# EAGLE board Papilio_Benchy (EAGLE 6.5.0)
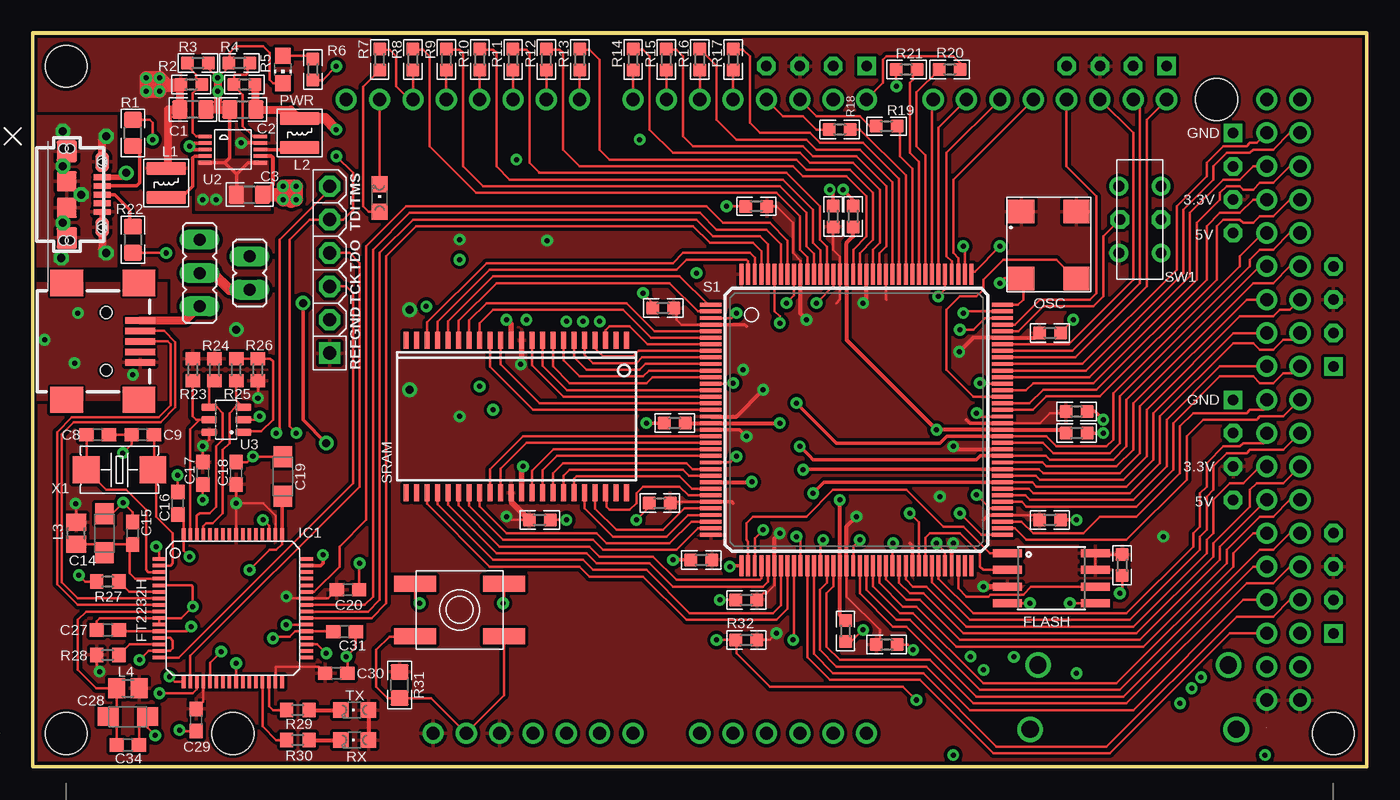
[diagram p6: board, top side]
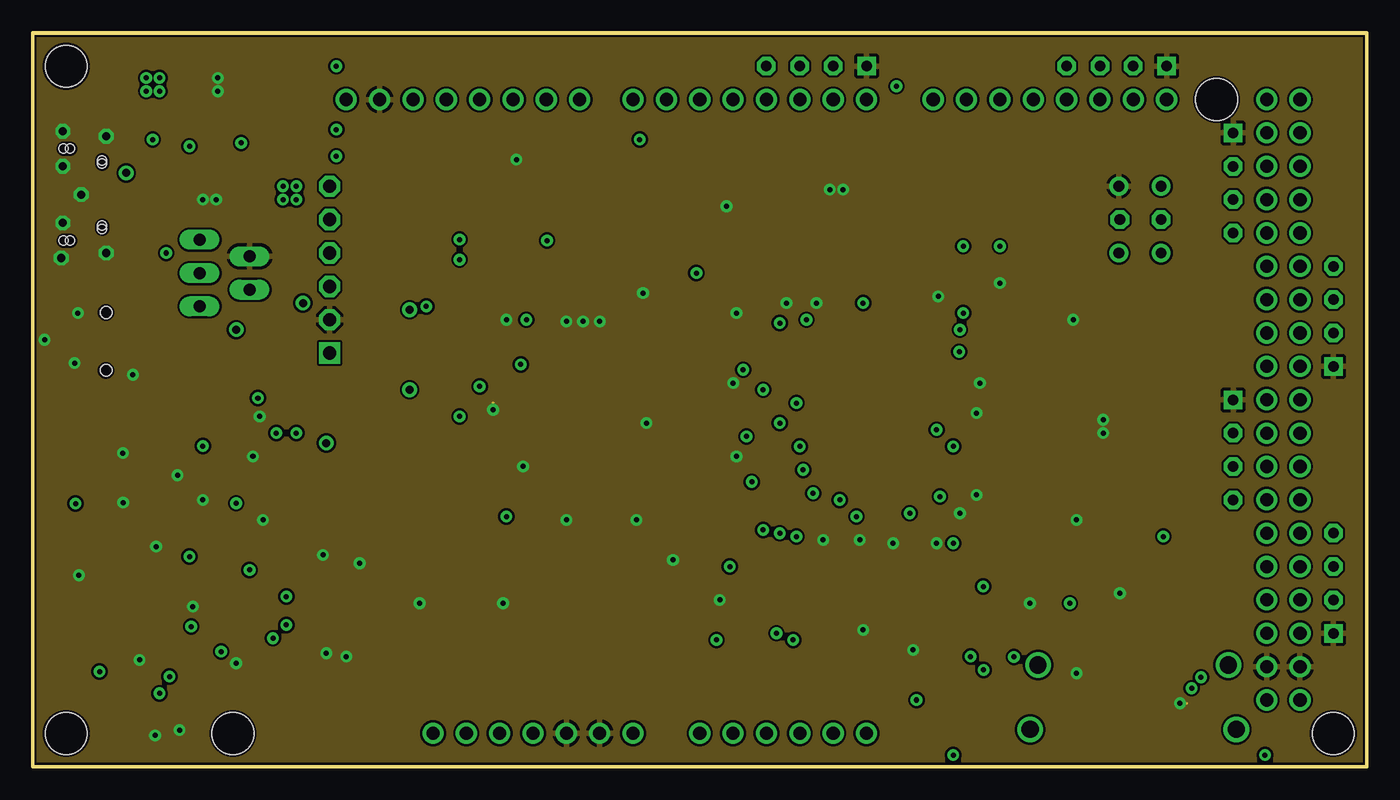
[diagram p7: board, inner layer Route2]
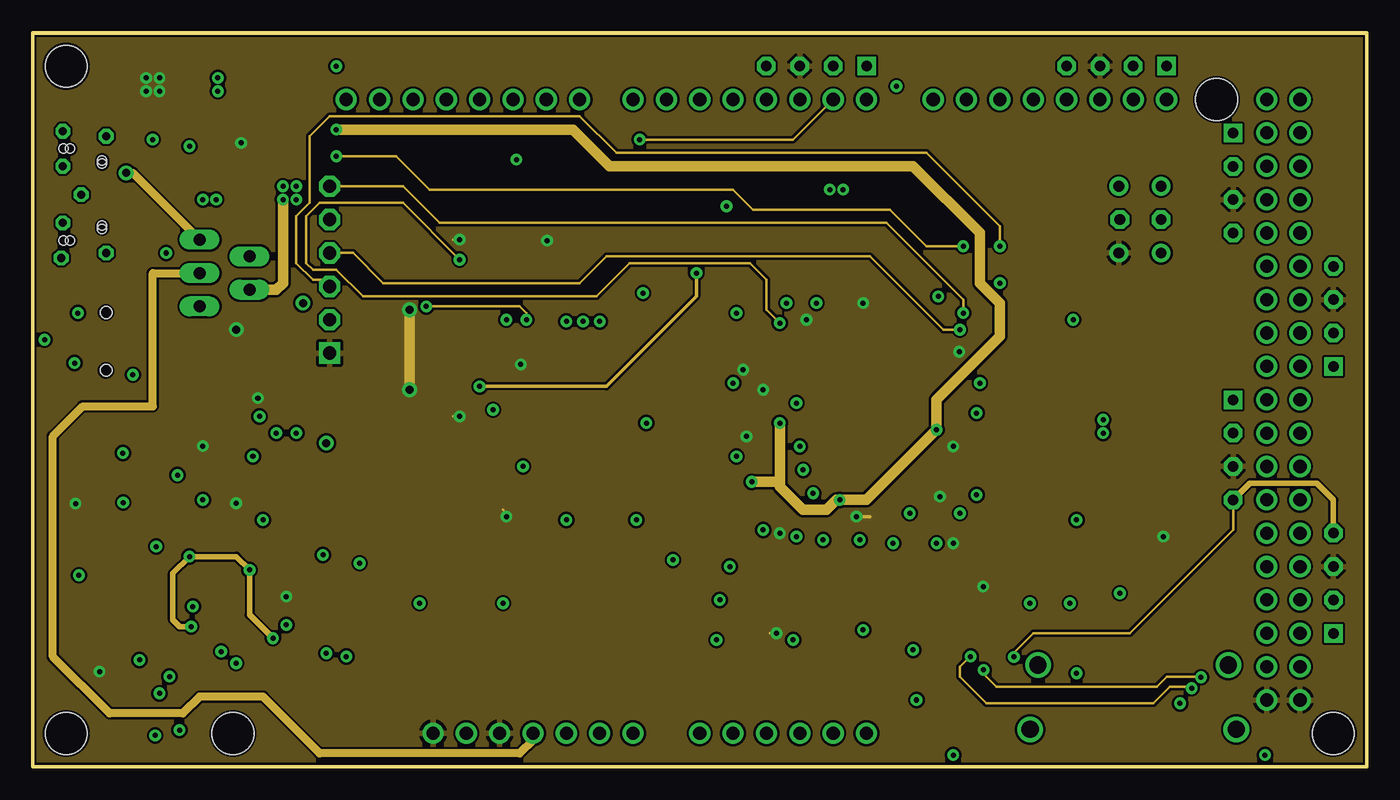
[diagram p8: board, inner layer Route3]
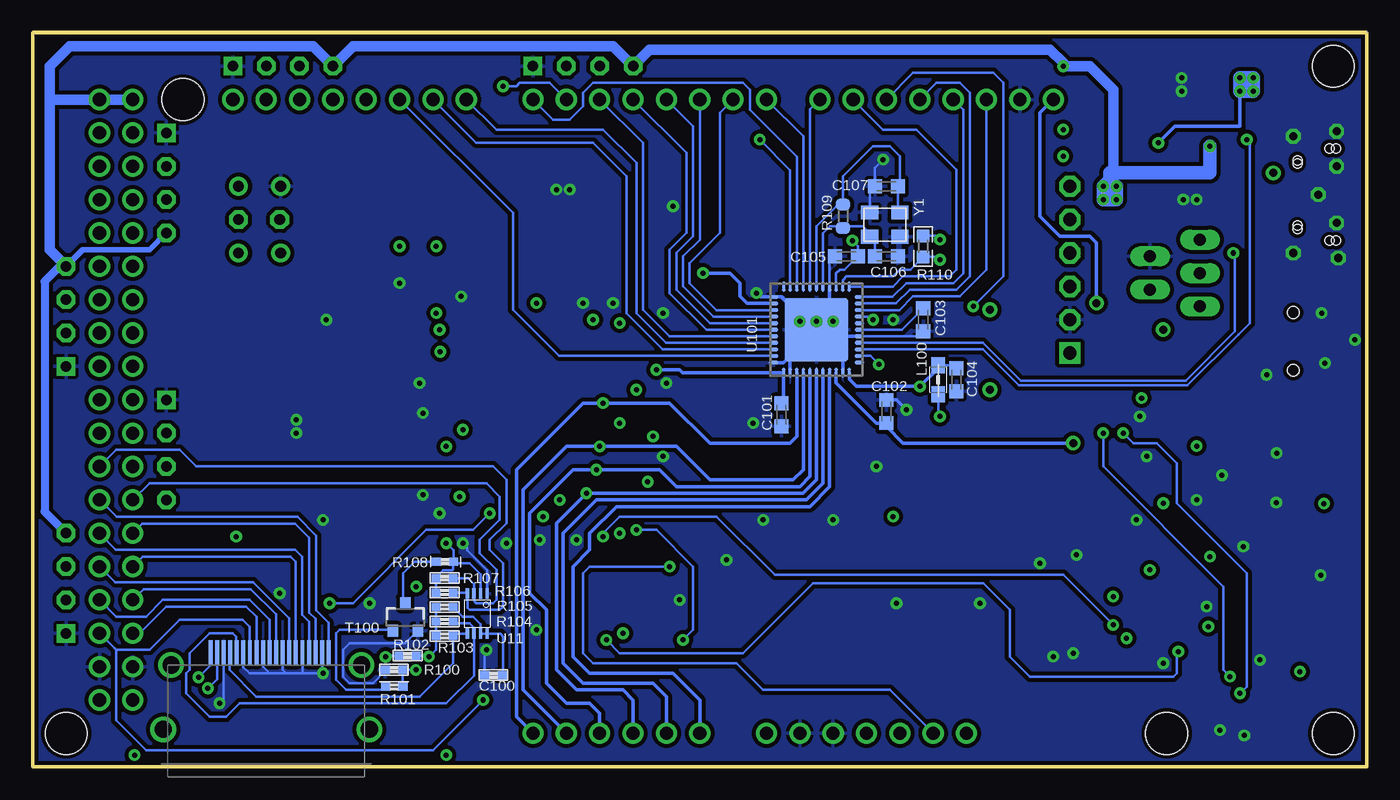
[diagram p9: board, bottom side, seen from below]

Size 101.6 x 55.88 mm. Coordinates in mm from the lower left corner, seen from the top.
Outline: 0,55.88 101.6,55.88 101.6,0 0,0 0,55.88
Outline: 0,55.88 57.15,55.88
Copper layers (1*2+3*16): Top 0.035mm / dielectric 1.5mm / Route2 0.035mm / dielectric 0.15mm / Route3 0.035mm / dielectric 0.2mm / Bottom 0.035mm
Design rules "SparkFun_Derived_GoldePheonix_7mil *": minimum track width 7mil, minimum drill 15mil, track to track 7mil, track to pad 7mil, pad to pad 7mil, via to via 7mil, smd to smd 7mil, copper to edge 7mil, drill to drill 7mil, minimum pad ring 12mil, minimum via ring 10mil, stop-mask expansion 4mil, vias tented up to drill 24mil, thermal gap 10mil
Net classes: 0 default: width 0.178 mm, drill 0.381 mm, clearance 0.178 mm; 1 Power: width 0.254 mm, drill 0.381 mm, clearance 0.178 mm; 2 gnd: width 0.254 mm, drill 0.61 mm, clearance 0.254 mm; 3 usbvcc: width 0.254 mm, drill 0.61 mm, clearance 0.254 mm; 4 aref: width 0.254 mm, drill 0.61 mm, clearance 0.254 mm
Holes 3.2 mm at 2.54,2.54 2.54,53.34 99.06,2.54

## Footprints (pad centres in the part's own frame; a part is rotated, then mirrored left to right if it is on the bottom)
CON2_USB_MICRO_B_AT = smd 0.406 x 1.346: P1 -1.321,2.692; P2 -0.66,2.692; P3 0,2.692; P4 0.66,2.692; P5 1.321,2.692 | smd 1.651 x 1.549: S1 -3.302,0; S2 3.302,0 | smd 1.524 x 1.016: S3 -2.489,2.692; S4 2.489,2.692 | smd 1.524 x 1.524: S5 -1.016,0; S6 1.016,0 | hole 0.7: -3.505,0.254; -3.505,-0.254; 3.505,0.254; 3.505,-0.254; -2.616,2.692; -2.362,2.692; 2.362,2.692; 2.616,2.692
0805 = smd 1.2 x 1.4: 1 -1,0; 2 1,0
0603 = smd 1 x 1: 1 -0.8,0; 2 0.8,0
C603 = smd 1.1 x 1: 1 -0.85,0; 2 0.85,0
SMC_A = smd 1.6 x 1.4: + -1.5,0; - 1.5,0
0402 = smd 0.7 x 0.6: 1 -0.655,0; 2 0.655,0
C0603K = smd 1.05 x 1.08: 1 -0.875,0; 2 0.875,0
SO08-EIAJ = smd 0.61 x 2.21: 1 -1.905,-3.378; 2 -0.635,-3.378; 3 0.635,-3.378; 4 1.905,-3.378; 5 1.905,3.353; 6 0.635,3.353; 7 -0.635,3.353; 8 -1.905,3.353
CONN_USB_MINI-B = smd 2 x 2.5: BODY@1 -4.45,2.5; BODY@2 4.45,2.5; BODY@3 4.45,-3; BODY@4 -4.45,-3 | smd 0.5 x 2.3: D+ 0,2.6; D- -0.8,2.6; GND 1.6,2.6; ID 0.8,2.6; VUSB -1.6,2.6 | hole 0.9: -2.2,0; 2.2,0
FCI-HDMI-TYPE-A-RECEPT = smd 1.9 x 0.3: 1 -0.95,4.5; 2 -0.95,4; 3 -0.95,3.5; 4 -0.95,3; 5 -0.95,2.5; 6 -0.95,2; 7 -0.95,1.5; 8 -0.95,1; 9 -0.95,0.5; 10 -0.95,0; 11 -0.95,-0.5; 12 -0.95,-1; 13 -0.95,-1.5; 14 -0.95,-2; 15 -0.95,-2.5; 16 -0.95,-3; 17 -0.95,-3.5; 18 -0.95,-4; 19 -0.95,-4.5 | drill 1.3: SH1 4.9,7.6; SH2 0,7; SH3 0,-7.5; SH4 4.9,-8.1
LQFP64 = smd 1 x 0.27: 1 -5.6,3.75; 2 -5.6,3.25; 3 -5.6,2.75; 4 -5.6,2.25; 5 -5.6,1.75; 6 -5.6,1.25; 7 -5.6,0.75; 8 -5.6,0.25; 9 -5.6,-0.25; 10 -5.6,-0.75; 11 -5.6,-1.25; 12 -5.6,-1.75; 13 -5.6,-2.25; 14 -5.6,-2.75; 15 -5.6,-3.25; 16 -5.6,-3.75; 33 5.6,-3.75; 34 5.6,-3.25; 35 5.6,-2.75; 36 5.6,-2.25; 37 5.6,-1.75; 38 5.6,-1.25; 39 5.6,-0.75; 40 5.6,-0.25; 41 5.6,0.25; 42 5.6,0.75; 43 5.6,1.25; 44 5.6,1.75; 45 5.6,2.25; 46 5.6,2.75; 47 5.6,3.25; 48 5.6,3.75 | smd 0.27 x 1: 17 -3.75,-5.6; 18 -3.25,-5.6; 19 -2.75,-5.6; 20 -2.25,-5.6; 21 -1.75,-5.6; 22 -1.25,-5.6; 23 -0.75,-5.6; 24 -0.25,-5.6; 25 0.25,-5.6; 26 0.75,-5.6; 27 1.25,-5.6; 28 1.75,-5.6; 29 2.25,-5.6; 30 2.75,-5.6; 31 3.25,-5.6; 32 3.75,-5.6; 49 3.75,5.6; 50 3.25,5.6; 51 2.75,5.6; 52 2.25,5.6; 53 1.75,5.6; 54 1.25,5.6; 55 0.75,5.6; 56 0.25,5.6; 57 -0.25,5.6; 58 -0.75,5.6; 59 -1.25,5.6; 60 -1.75,5.6; 61 -2.25,5.6; 62 -2.75,5.6; 63 -3.25,5.6; 64 -3.75,5.6
VLS3015 = smd 3 x 1: 1 0,1.1; 2 0,-1.1
FB603 = smd 1.3 x 1.5: 1 -0.85,0; 2 0.85,0
0805' = smd 1.2 x 1: 1 -1.1,0; 2 1.1,0
CHIPLED_0805 = smd 1.2 x 1.2: A 0,-1.05; C 0,1.05
OSC1 = smd 1.8 x 2: 1@1 0,0; 2@2 5.08,0; 3@3 5.08,4.2; 4@4 0,4.2
CHIP-LED0805 = smd 1.2 x 1.2: A 0,-1.05; C 0,1.05
JP1 = drill 0.914 long: 1 0,-1.27; 2 0,1.27
JP2 = drill 0.914 long: 1 -2.54,0; 2 0,0; 3 2.54,0
R603 = smd 1 x 1.1: 1 -0.85,0; 2 0.85,0
R0603-ROUND = smd 0.898 x 1.1: 1 -0.889,0; 2 0.889,0
LED-805 = smd 1.2 x 1.2: A 0,-1.05; C 0,1.05
TQ144 = smd 1.6 x 0.3: 1 -11.1,8.75; 2 -11.1,8.25; 3 -11.1,7.75; 4 -11.1,7.25; 5 -11.1,6.75; 6 -11.1,6.25; 7 -11.1,5.75; 8 -11.1,5.25; 9 -11.1,4.75; 10 -11.1,4.25; 11 -11.1,3.75; 12 -11.1,3.25; 13 -11.1,2.75; 14 -11.1,2.25; 15 -11.1,1.75; 16 -11.1,1.25; 17 -11.1,0.75; 18 -11.1,0.25; 19 -11.1,-0.25; 20 -11.1,-0.75; 21 -11.1,-1.25; 22 -11.1,-1.75; 23 -11.1,-2.25; 24 -11.1,-2.75; 25 -11.1,-3.25; 26 -11.1,-3.75; 27 -11.1,-4.25; 28 -11.1,-4.75; 29 -11.1,-5.25; 30 -11.1,-5.75; 31 -11.1,-6.25; 32 -11.1,-6.75; 33 -11.1,-7.25; 34 -11.1,-7.75; 35 -11.1,-8.25; 36 -11.1,-8.75; 73 11.1,-8.75; 74 11.1,-8.25; 75 11.1,-7.75; 76 11.1,-7.25; 77 11.1,-6.75; 78 11.1,-6.25; 79 11.1,-5.75; 80 11.1,-5.25; 81 11.1,-4.75; 82 11.1,-4.25; 83 11.1,-3.75; 84 11.1,-3.25; 85 11.1,-2.75; 86 11.1,-2.25; 87 11.1,-1.75; 88 11.1,-1.25; 89 11.1,-0.75; 90 11.1,-0.25; 91 11.1,0.25; 92 11.1,0.75; 93 11.1,1.25; 94 11.1,1.75; 95 11.1,2.25; 96 11.1,2.75; 97 11.1,3.25; 98 11.1,3.75; 99 11.1,4.25; 100 11.1,4.75; 101 11.1,5.25; 102 11.1,5.75; 103 11.1,6.25; 104 11.1,6.75; 105 11.1,7.25; 106 11.1,7.75; 107 11.1,8.25; 108 11.1,8.75 | smd 0.3 x 1.6: 37 -8.75,-11.1; 38 -8.25,-11.1; 39 -7.75,-11.1; 40 -7.25,-11.1; 41 -6.75,-11.1; 42 -6.25,-11.1; 43 -5.75,-11.1; 44 -5.25,-11.1; 45 -4.75,-11.1; 46 -4.25,-11.1; 47 -3.75,-11.1; 48 -3.25,-11.1; 49 -2.75,-11.1; 50 -2.25,-11.1; 51 -1.75,-11.1; 52 -1.25,-11.1; 53 -0.75,-11.1; 54 -0.25,-11.1; 55 0.25,-11.1; 56 0.75,-11.1; 57 1.25,-11.1; 58 1.75,-11.1; 59 2.25,-11.1; 60 2.75,-11.1; 61 3.25,-11.1; 62 3.75,-11.1; 63 4.25,-11.1; 64 4.75,-11.1; 65 5.25,-11.1; 66 5.75,-11.1; 67 6.25,-11.1; 68 6.75,-11.1; 69 7.25,-11.1; 70 7.75,-11.1; 71 8.25,-11.1; 72 8.75,-11.1; 109 8.75,11.1; 110 8.25,11.1; 111 7.75,11.1; 112 7.25,11.1; 113 6.75,11.1; 114 6.25,11.1; 115 5.75,11.1; 116 5.25,11.1; 117 4.75,11.1; 118 4.25,11.1; 119 3.75,11.1; 120 3.25,11.1; 121 2.75,11.1; 122 2.25,11.1; 123 1.75,11.1; 124 1.25,11.1; 125 0.75,11.1; 126 0.25,11.1; 127 -0.25,11.1; 128 -0.75,11.1; 129 -1.25,11.1; 130 -1.75,11.1; 131 -2.25,11.1; 132 -2.75,11.1; 133 -3.25,11.1; 134 -3.75,11.1; 135 -4.25,11.1; 136 -4.75,11.1; 137 -5.25,11.1; 138 -5.75,11.1; 139 -6.25,11.1; 140 -6.75,11.1; 141 -7.25,11.1; 142 -7.75,11.1; 143 -8.25,11.1; 144 -8.75,11.1
TSOP44-II = smd 0.4 x 1.3: 1 -8.4,-5.8; 2 -7.6,-5.8; 3 -6.8,-5.8; 4 -6,-5.8; 5 -5.2,-5.8; 6 -4.4,-5.8; 7 -3.6,-5.8; 8 -2.8,-5.8; 9 -2,-5.8; 10 -1.2,-5.8; 11 -0.4,-5.8; 12 0.4,-5.8; 13 1.2,-5.8; 14 2,-5.8; 15 2.8,-5.8; 16 3.6,-5.8; 17 4.4,-5.8; 18 5.2,-5.8; 19 6,-5.8; 20 6.8,-5.8; 21 7.6,-5.8; 22 8.4,-5.8; 23 8.4,5.8; 24 7.6,5.8; 25 6.8,5.8; 26 6,5.8; 27 5.2,5.8; 28 4.4,5.8; 29 3.6,5.8; 30 2.8,5.8; 31 2,5.8; 32 1.2,5.8; 33 0.4,5.8; 34 -0.4,5.8; 35 -1.2,5.8; 36 -2,5.8; 37 -2.8,5.8; 38 -3.6,5.8; 39 -4.4,5.8; 40 -5.2,5.8; 41 -6,5.8; 42 -6.8,5.8; 43 -7.6,5.8; 44 -8.4,5.8
6P-2CH-2.54-9.1X3.5X3.2+2H = drill 0.813 pad 1.27: CH1A -2.54,-1.6; CH1B 2.54,-1.6; CH2A -2.54,1.6; CH2B 2.54,1.6 | drill 0.813 pad 1.27 octagon: COM1 0,-1.6; COM2 0,1.524
EVQ-Q2 = smd 3.2 x 1.2: A -3.4,-2; A' 3.4,-2; B -3.4,2; B' 3.4,2
SOT23-3 = smd 0.8 x 0.9: 1 -0.95,-1; 2 0.95,-1; 3 0,1.1
ARDUINO_MEGA_SHIELD = drill 1 pad 1.422: 3.3V 50.8,26.67; 3V3@1 48.26,85.09; 3V3@2 48.26,87.63; 5V@0 50.8,29.21; 5V@1 2.54,85.09; 5V@2 2.54,87.63; A0 50.8,41.91; A1 50.8,44.45; A2 50.8,46.99; A3 50.8,49.53; A4 50.8,52.07; A5 50.8,54.61; AREF 2.54,14.986; D2 2.54,49.53; D3 2.54,46.99; D4 2.54,44.45; D5 2.54,41.91; D6 2.54,39.37; D7 2.54,36.83; D8 2.54,32.766; D9 2.54,30.226; D10 2.54,27.686; D11 2.54,25.146; D12 2.54,22.606; D13 2.54,20.066; D14 2.54,59.69; D15 2.54,62.23; D16 2.54,64.77; D17 2.54,67.31; D18 2.54,69.85; D19 2.54,72.39; D20 2.54,74.93; D21 2.54,77.47; D22 5.08,85.09; D23 5.08,87.63; D24 7.62,85.09; D25 7.62,87.63; D26 10.16,85.09; D27 10.16,87.63; D28 12.7,85.09; D29 12.7,87.63; D30 15.24,85.09; D31 15.24,87.63; D32 17.78,85.09; D33 17.78,87.63; D34 20.32,85.09; D35 20.32,87.63; D36 22.86,85.09; D37 22.86,87.63; D38 25.4,85.09; D39 25.4,87.63; D40 27.94,85.09; D41 27.94,87.63; D42 30.48,85.09; D43 30.48,87.63; D44 33.02,85.09; D45 33.02,87.63; D46 35.56,85.09; D47 35.56,87.63; D48 38.1,85.09; D49 38.1,87.63; D50 40.64,85.09; D51 40.64,87.63; D52 43.18,85.09; D53 43.18,87.63; GND@0 50.8,31.75; GND@1 50.8,34.29; GND@2 2.54,17.526; GND@3 45.72,85.09; GND@4 45.72,87.63; IOREF 50.8,21.59; RES 50.8,24.13; RX 2.54,54.61; TX 2.54,52.07; VIN 50.8,36.83 | hole 3.2: 2.54,81.28; 50.8,6.35
MSOP10 = smd 0.28 x 1: 1 -1,-2.1; 2 -0.5,-2.1; 3 0,-2.1; 4 0.5,-2.1; 5 1,-2.1; 6 1,2.1; 7 0.5,2.1; 8 0,2.1; 9 -0.5,2.1; 10 -1,2.1
SOT23-6 = smd 0.55 x 1.2: 1 -0.95,-1.3; 2 0,-1.3; 3 0.95,-1.3; 4 0.95,1.3; 5 0,1.3; 6 -0.95,1.3
PSOP-8 = smd 0.25 x 0.8: 1 -0.73,-1.52; 2 -0.23,-1.52; 3 0.27,-1.52; 4 0.77,-1.52; 5 0.77,1.53; 6 0.27,1.53; 7 -0.23,1.53; 8 -0.73,1.53
QFN44ML7X7 = smd 0.75 x 0.275: 1 -3.275,2.5; 2 -3.275,2; 3 -3.275,1.5; 4 -3.275,1; 5 -3.275,0.5; 6 -3.275,0; 7 -3.275,-0.5; 8 -3.275,-1; 9 -3.275,-1.5; 10 -3.275,-2; 11 -3.275,-2.5; 23 3.275,-2.5; 24 3.275,-2; 25 3.275,-1.5; 26 3.275,-1; 27 3.275,-0.5; 28 3.275,0; 29 3.275,0.5; 30 3.275,1; 31 3.275,1.5; 32 3.275,2; 33 3.275,2.5 | smd 0.275 x 0.75: 12 -2.5,-3.275; 13 -2,-3.275; 14 -1.5,-3.275; 15 -1,-3.275; 16 -0.5,-3.275; 17 0,-3.275; 18 0.5,-3.275; 19 1,-3.275; 20 1.5,-3.275; 21 2,-3.275; 22 2.5,-3.275; 34 2.5,3.275; 35 2,3.275; 36 1.5,3.275; 37 1,3.275; 38 0.5,3.275; 39 0,3.275; 40 -0.5,3.275; 41 -1,3.275; 42 -1.5,3.275; 43 -2,3.275; 44 -2.5,3.275 | smd 4.826 x 4.826: EXP 0,0
JTAG = drill 1.016 octagon: JTAG_GND 10.16,0; JTAG_TCK 7.62,0; JTAG_TDI 2.54,0; JTAG_TDO 5.08,0; JTAG_TMS 0,0 | drill 1.016 square: JTAG_REF 12.7,0
POWER_NO_TEXT = drill 0.8 square: P1 0,3.81 | drill 0.8 octagon: P2 0,1.27; P3 0,-1.27; P4 0,-3.81
4X6 = smd 2.032 x 2.032: 1 -2.54,0; 2 2.54,0
CRYSTAL-3.2-2.5 = smd 1.3 x 1.05: 1 -1.15,-0.925; 2 1.15,-0.925; 3 1.15,0.925; 4 -1.15,0.925

## Placement (x,y rotation side)
AVRUSB  USB MICRO  [CON2_USB_MICRO_B_AT]  2.59,43.56 270 top
C1  22u/6V3  [0805]  12.19,50.04 180 top
C2  22u/6V3  [0805]  16,50.04 0 top
C3  10u/10V  [0805]  16.51,43.56 0 top
C4  .1uF  [0603]  48.01,34.92 180 top
C5  .1uF  [0603]  55.12,42.67 180 top
C6  .1uF  [0603]  60.96,41.91 90 top
C7  .1uF  [0603]  62.48,41.91 90 top
C8  27pF  [C603]  4.95,25.27 0 top
C9  27pF  [C603]  8.38,25.27 180 top
C10  .1uF  [0603]  48.9,26.16 180 top
C11  .1uF  [0603]  77.47,33.02 0 top
C12  .1uF  [0603]  79.5,27.05 0 top
C13  .1uF  [0603]  79.5,25.4 0 top
C14  4.7uF  [SMC_A]  5.46,17.78 90 top
C15  0.1uF  [C603]  7.62,17.78 90 top
C16  0.1uF  [C603]  11.05,20.07 90 top
C17  0.1uF  [C603]  12.95,22.35 270 top
C18  0.1uF  [C603]  15.49,22.35 90 top
C19  3.3uF  [SMC_A]  19.05,22.1 90 top
C20  0.1uF  [C603]  24,13.46 0 top
C21  .1uF  [0603]  38.61,18.8 0 top
C22  .1uF  [0603]  47.75,20.07 180 top
C23  .1uF  [0603]  50.93,15.75 180 top
C24  .1uF  [0603]  54.36,12.7 180 top
C25  .1uF  [0603]  77.47,18.8 0 top
C26  .1uF  [0603]  82.98,15.34 270 top
C27  0.1uF  [C603]  5.71,10.41 180 top
C28  4.7uF  [SMC_A]  7.24,3.81 0 top
C29  0.1uF  [C603]  12.45,3.56 270 top
C30  0.1uF  [C603]  23.11,7.11 0 top
C31  0.1uF  [C603]  23.75,10.29 0 top
C32  .1uF  [0603]  61.9,10.34 270 top
C33  .1uF  [0603]  65.05,9.3 0 top
C34  0.1uF  [C603]  7.24,1.65 0 top
C100  1uF  [0402]  66.52,6.97 180 bottom
C101  100n  [C0603K]  44.58,26.8 270 bottom
C102  100n  [C0603K]  36.58,27.05 270 bottom
C103  1uF  [C0603K]  33.78,34.04 270 bottom
C104  1uF  [C0603K]  31.24,29.46 270 bottom
C105  100n  [C0603K]  39.62,38.86 180 bottom
C106  22p  [C0603K]  36.58,38.86 180 bottom
C107  22p  [C0603K]  36.58,44.2 180 bottom
FLASH  FLASH-SPI-25XXSMD1  [SO08-EIAJ]  77.6,14.35 270 top
FPGAUSB  CONN_USB  [CONN_USB_MINI-B]  5.59,32.38 270 top
HDMI  HDMI-TYPE-A-RECEPTICALFCI10029449  [FCI-HDMI-TYPE-A-RECEPT]  83.57,7.74 270 bottom
IC1  FT2232H  [LQFP64]  15.24,12.06 0 top
L1  3.3uH  [VLS3015]  10.16,44.45 180 top
L2  3.3uH  [VLS3015]  20.32,48.26 180 top
L3  [FB603]  3.3,17.78 90 top
L4  [FB603]  7.24,5.97 0 top
L100  MH2029-300Y  [0805']  32.64,29.46 90 bottom
LED  Yellow  [CHIPLED_0805]  26.42,43.31 0 top
OSC  [OSC1]  75.29,42.27 270 top
PWR  Green  [CHIP-LED0805]  19.05,53.09 180 top
PWRIN  [JP1]  16.51,37.59 0 top
PWRSEL  [JP2]  12.7,37.59 90 top
R1  22R  [0805]  7.62,48.26 90 top
R2  6K8 1%  [0603]  12.06,51.94 180 top
R3  1K5 1%  [0603]  12.57,53.59 180 top
R4  1K5 1%  [0603]  15.75,53.59 0 top
R5  1K5 1%  [0603]  16.13,51.94 0 top
R6  1K8  [0603]  21.34,53.09 270 top
R7  1K  [0603]  26.42,53.85 90 top
R8  390  [0603]  28.96,53.85 270 top
R9  390  [0603]  31.5,53.85 270 top
R10  390  [0603]  34.04,53.85 270 top
R11  390  [0603]  36.58,53.85 270 top
R12  390  [0603]  39.12,53.85 270 top
R13  390  [0603]  41.66,53.85 270 top
R14  390  [0603]  45.72,53.85 270 top
R15  390  [0603]  48.26,53.85 270 top
R16  390  [0603]  50.8,53.85 270 top
R17  390  [0603]  53.34,53.85 270 top
R18  390  [0603]  61.47,48.51 180 top
R19  390  [0603]  65.02,48.77 180 top
R20  390  [0603]  66.55,53.09 180 top
R21  390  [0603]  69.85,53.09 0 top
R22  22R  [0805]  7.62,40.13 270 top
R23  10k  [R603]  12.19,30.23 90 top
R24  10k  [R603]  13.84,30.23 90 top
R25  2.2k  [R603]  15.49,30.23 270 top
R26  10k  [R603]  17.14,30.23 270 top
R27  12k 1%  [R603]  5.71,14.1 0 top
R28  10k  [R603]  5.71,8.51 0 top
R29  470  [R603]  20.19,4.32 0 top
R30  470  [R603]  20.19,2.03 0 top
R31  47K  [0805]  27.94,6.22 90 top
R32  4.7K  [0603]  54.36,9.65 0 top
R100  10K  [0402]  74.1,7.38 0 bottom
R101  10K  [0402]  74.07,6.08 180 bottom
R102  0  [0402]  73.05,8.45 180 bottom
R103  1K  [0402]  70.23,9.96 0 bottom
R104  1K  [0402]  70.23,11.06 0 bottom
R105  100K  [0402]  70.23,12.16 180 bottom
R106  1K  [0402]  70.23,13.26 0 bottom
R107  1K  [0402]  70.23,14.36 0 bottom
R108  2.2K  [0402]  70.21,15.61 180 bottom
R109  1M  [R0603-ROUND]  39.88,41.91 270 bottom
R110  10K  [0603]  33.78,39.62 90 bottom
RX  [LED-805]  24.51,2.03 90 top
S1  6SLX9TQG144  [TQ144]  62.74,26.42 0 top
SRAM  ISSI_SRAM_8BIT  [TSOP44-II]  36.83,26.67 180 top
SW1  SWITCH-2CH-6P-3010010P1  [6P-2CH-2.54-9.1X3.5X3.2+2H]  84.33,41.66 90 top
SW2  EVQQ2  [EVQ-Q2]  32.51,11.94 0 top
T100  MOSFET-NCHANNELSMD  [SOT23-3]  73.23,11.36 0 bottom
TX  [LED-805]  24.51,4.32 90 top
U1  ARDUINO_MEGA_SHIELD  [ARDUINO_MEGA_SHIELD]  8.89,53.34 270 top
U2  LTC3419EMS  [MSOP10]  15.24,46.99 270 top
U3  93C46B  [SOT23-6]  14.73,26.42 90 top
U100  PCA9306  [PSOP-8]  67.73,11.66 180 bottom
U101  ATMEGA32U4-XUMU  [QFN44ML7X7]  41.91,33.27 180 bottom
U$1  JTAG_XILINX  [JTAG]  22.61,44.2 270 top
U$2  POWER_ONLYNOTEXT  [POWER_NO_TEXT]  59.69,53.34 270 top
U$3  POWER_ONLYNOTEXT  [POWER_NO_TEXT]  82.55,53.34 270 top
U$4  POWER_ONLYNOTEXT  [POWER_NO_TEXT]  91.44,44.45 0 top
U$5  POWER_ONLYNOTEXT  [POWER_NO_TEXT]  99.06,34.29 180 top
U$6  POWER_ONLYNOTEXT  [POWER_NO_TEXT]  91.44,24.13 0 top
U$7  [GADGETFACTORY_LOGO]  40.51,14.61 0 top
U$8  POWER_ONLYNOTEXT  [POWER_NO_TEXT]  99.06,13.97 180 top
X1  12MHz  [4X6]  6.6,22.61 180 top
Y1  16MHz KX-7  [CRYSTAL-3.2-2.5]  36.7,41.27 180 bottom

## Tracks (layer width: path | path; a pad name or v marks a point on that pad's centre or on a via)
1.8V  (via drill 0.38)
  Top 0.203: v12.06,10.67 11.71,10.31 IC1.12 6.66,10.31 C27.1 | v11.94,16 11.49,16.45 IC1.64 11.49,18.77 C16.1 | v18.29,9.78 18.41,9.91 19.56,9.91 19.97,10.31 IC1.37 22.87,10.31 C31.1 | IC1.49 18.99,16.96 18.54,16.51 18.03,16.51 v16.51,14.99
  Top 0.254: IC1.49 18.99,20.54 C19.+
  Route3 0.406: v12.06,10.67 11.18,10.67 10.67,11.18 10.67,14.73 v11.94,16 15.49,16 v16.51,14.99 16.51,11.56 v18.29,9.78
1V2  (via drill 0.38)
  Top 0.203: 61.99,39.87 61.98,39.88 | 61.49,20.3 v61.47,20.32 | v56.89,26.17 v56.9,26.16 | 54.74,21.67 v54.76,21.69 | 68.85,25.67 v68.83,25.65 | 61.99,32.78 61.98,32.77
  Top 0.254: S1.19
  Top 0.305: 61.98,39.88 62.48,40.39 C7.1 | C10.1 S1.19 | 61.99,39.87 S1.128 61.99,32.78 61.99,32.5 v68.83,25.65 | 61.49,20.3 S1.52 61.49,11.55 C32.1 | S1.19 v56.89,26.17 | S1.28 54.74,21.67 | C13.1 78.44,25.67 S1.89 68.85,25.67
  Top 0.61: L2.2 19.64,50.04 C2.2 16.93,50.11 R5.2
  Top 0.813: L2.2 22.27,49.36 v23.11,48.51
  Route3 0.813: v23.11,48.51 41.15,48.51 43.94,45.72 67.06,45.72 72.14,40.64 72.14,36.83 73.66,35.31 73.66,32.77 68.83,27.94 v68.83,25.65 63.5,20.32 v61.47,20.32 61.21,20.32 60.45,19.56 58.67,19.56 56.9,21.34 56.9,21.59 | v56.9,26.16 56.9,21.59 | v54.76,21.69 56.79,21.69 56.9,21.59
3V3  (via drill 0.38, 0.6, 0.61)
  Top 0.178: IC1.31 18.49,7.57 18.54,7.62 21.76,7.62 C30.1
  Top 0.203: C6.1 60.96,39.37 61.49,38.84 S1.129 61.49,35.58 61.21,35.31 | S1.31 48.65,20.17 C22.1 | S1.42 56.49,13.82 55.88,13.21 55.66,13.21 C24.1 | S1.122 64.99,35.6 65.02,35.56 | 78.58,26.93 C12.1 78.58,26.92 77.47,26.92 76.71,26.17 S1.90 | C5.1 56.64,42.67 57.91,41.4 57.91,39.12 58.49,38.54 S1.135 | S1.76 76.3,19.17 C25.1 | C26.1 81.06,16.14 FLASH.8 FLASH.7 | S1.53 61.99,12.94 64.52,10.41 64.52,9.56 C33.1 | 69.99,16.9 v70.1,17.02 | 36.94,19.67 36.92,19.67 | 36.45,20.85 SRAM.33 | v19.3,12.95 19.44,12.81 IC1.42 22.51,12.81 C20.1 | R26.2 v17.14,28.07 | R28.1 4.87,7.45 v5.08,7.24 | L3.2 3.3,19.99 v3.25,20.04 | C18.1 v15.49,20.07 | IC1.56 v15.49,20.06 v15.49,20.07 | IC1.50 18.49,19.1 17.53,20.07 v15.49,20.07 | U3.6 13.43,24.89 v12.95,24.41 C17.1 | IC1.20 12.99,4.95 C29.1 | C21.1 36.32,18.8 v36.07,19.05 | S1.4 49.39,33.67 49.02,34.04 49.02,34.71 C4.1 | R32.2 56.13,9.65 v56.64,10.16
  Top 0.254: S1.122 65.02,37.55 | S1.4 54.22,33.67 54.36,33.53 | S1.18 53.34,26.67 | S1.20 53.84,25.67 v54.36,25.15 | S1.31 53.24,20.17 53.34,20.07 | S1.63 66.99,16.83 66.8,17.02 | S1.76 72.76,19.17 72.39,18.8 | S1.90 71.37,26.17 71.12,26.42 | U2.9 v15.88,47.5
  Top 0.305: S1.86 70.32,24.17 v70.1,24.38 | S1.69 69.99,16.9 | S1.135 58.49,34.48 v58.93,34.04 | S1.125 63.49,35.55 v63.25,35.31 | TX.A RX.A | v70.56,31.6 71.63,32.67 S1.103 76.32,32.67 C11.1 | S1.42 56.49,17.37 v56.9,17.78 | S1.53 61.99,18.3 v62.74,19.05 | S1.18 53.59,26.67 v55.63,28.7
  Top 0.406: C21.1 36.94,19.67 | v72.39,13.72 FLASH.3 | 36.92,19.67 36.45,20.14 36.45,20.85 | SRAM.11 37.23,30.7 v37.16,30.63
  Top 0.61: R2.2 11.19,51.87 C1.2 10.29,50.04 10.29,45.68 L1.2
  Top 1.016: 11.19,51.87 10.23,51.87 v9.65,52.45 v8.64,52.45 v8.64,51.44 v9.65,51.44
  Route3 0.178: v32.51,26.67 32,26.67
  Route3 0.203: v36.07,19.05 36.07,19.3 35.81,19.56 | v32.51,40.13 32,40.13 | v56.64,10.16 56.13,10.16 | v56.9,17.78 57.15,17.78
  Route3 0.254: v62.74,19.05 63.75,19.05
  Route3 0.305: v55.63,28.7 55.88,28.7
  Route3 0.813: v28.7,28.7 v28.7,34.8
  Bottom 0.178: L100.1 32.64,26.8 v32.51,26.67
  Bottom 0.203: U101.2 37.8,31.27 v37.16,30.63 | R110.2 32.8,40.42 v32.51,40.13 | U101.14 40.41,37.57 40.13,37.85 39.77,37.85 C105.1 38.75,39.64 v39.17,40.06 | R108.1 69.56,15.71 | R106.1 R107.1 70.89,14.41 70.33,14.96 69.67,14.96 69.6,15.04 69.6,15.57 R108.1 | U100.2 67.5,14.67 68.33,15.49 69.44,15.49 R108.1 | R108.1 69.56,16.47 v70.1,17.02
  Bottom 0.254: v15.88,47.5 14.61,48.77 9.65,48.77 v9.65,51.44 | v54.1,30.23 52.32,30.23 52.1,30 U101.34 44.41,27.84 C101.1
  Bottom 1.016: v9.65,51.44 v8.64,51.44 v8.64,52.45 v9.65,52.45 v9.65,51.44
  other vias: 86.11,17.53 69.09,20.57 15.49,33.27
  pour Top (isolate 0.254, rank 3): 0,55.88 0,0 101.6,0 101.6,55.88
  pour Route3: 0,55.88 101.6,55.88 101.6,0 0,0
5V0  (via drill 0.38)
  Top 0.203: R6.2 22.06,52.29 v23.11,53.34
  Top 0.254: U2.3 12.19,46.99 v11.94,47.24 12.18,47.49 U2.2
  Top 0.305: U2.7 18.15,46.49 18.29,46.35 18.29,44.34 C3.2
  Top 0.813: 19.05,43.69 19.56,44.2 | PWRSEL.2 13.72,37.59 14.99,36.32 PWRIN.1
  Top 1.016: C3.2 18.67,43.56 v19.05,43.18 | v19.05,43.18 v19.05,44.2 19.56,44.2 v20.07,44.2 v20.07,43.18 19.81,43.18 | 19.81,43.18 v19.05,43.18 | 19.68,43.05 19.81,43.18
  Route3 0.203: v74.73,8.36 74.73,8.69 76.2,10.16 83.57,10.16 91.44,18.03 U$6.P4
  Route3 0.406: U$8.P4 99.06,20.32 97.79,21.59 92.71,21.59 U$6.P4
  Route3 0.61: U1.5V@0 38.1,2.03 37.08,1.02 21.84,1.02 17.53,5.33 12.7,5.33 11.43,4.06 5.84,4.06 1.52,8.38 1.52,25.15 3.81,27.43 9.14,27.43 9.14,37.59 PWRSEL.2
  Route3 0.813: v19.05,43.18 19.05,36.83 18.54,36.32 PWRIN.1
  Bottom 0.203: R102.2 74.63,8.45 v74.73,8.36
  Bottom 0.406: U$5.P4 97.79,39.37 92.71,39.37 U$4.P4
  Bottom 0.61: 19.3,44.45 v19.05,44.2 | U$8.P4 100.71,19.43 100.71,36.96 99.57,38.1 U$5.P4
  Bottom 0.813: 19.3,44.45 19.3,51.56 21.08,53.34 v23.11,53.34 23.11,53.59 24.13,54.61 54.61,54.61 U$2.P4 57.4,54.86 77.22,54.86 U$3.P4 80.26,54.86 98.81,54.86 100.33,53.34 100.33,50.8 | U1.5V@1 U1.5V@2 100.33,50.8 | 100.33,50.8 100.33,39.37 U$5.P4
  Bottom 1.016: v20.07,44.2 19.56,44.7 19.56,45.21 11.94,45.21 v11.94,47.24 | v20.07,44.2 v20.07,43.18 v19.05,43.18 v19.05,44.2 v20.07,44.2
5V_ARDUINO  (via drill 0.61)
  Top 0.406: AVRUSB.P1 6.78,44.88 v7.11,45.21
  Route3 0.406: 6.86,45.21 v7.11,45.21
  Route3 0.61: v7.11,45.21 7.62,45.21 PWRSEL.3
5V_FT2232
  Top 0.61: FPGAUSB.VUSB 11.63,33.98 PWRSEL.1
!CS
  Top 0.203: S1.12 47.19,29.67 46.74,29.21 40.89,29.21 39.63,30.47 SRAM.8
!OE
  Top 0.203: S1.26 50.23,22.67 49.78,23.11 40.39,23.11 39.63,22.36 SRAM.37
!RESET
  Top 0.203: IC1.14 7.37,9.31 R28.2
!WE
  Top 0.203: S1.6 47.09,32.67 44.96,34.8 35.05,34.8 34.03,33.78 SRAM.15
A0
  Top 0.203: S1.7 46.83,32.17 45.47,33.53 43.94,33.53 43.63,33.22 SRAM.3
A1
  Top 0.203: S1.8 46.14,31.67 45.72,31.24 43.43,31.24 42.83,31.85 SRAM.4
A2
  Top 0.203: S1.9 46.41,31.17 45.97,30.73 42.67,30.73 42.03,31.38 SRAM.5
A3
  Top 0.203: S1.10 46.67,30.67 46.23,30.23 42.16,30.23 41.23,31.16 SRAM.6
A4
  Top 0.203: S1.11 46.93,30.17 46.48,29.72 41.66,29.72 40.43,30.94 SRAM.7
A5
  Top 0.203: S1.5 47.35,33.17 45.21,35.31 34.54,35.31 33.23,33.99 SRAM.16
A6
  Top 0.203: SRAM.17 32.43,33.95 35.31,36.83 48.51,36.83 50.68,34.67 S1.2
A7
  Top 0.203: S1.1 51.45,35.17 49.28,37.34 35.05,37.34 31.63,33.92 SRAM.18
A8
  Top 0.203: SRAM.19 30.83,33.88 34.8,37.85 49.02,37.85 49.78,38.61 54.36,38.61 54.49,38.48 S1.143
A9
  Top 0.203: S1.142 54.99,38.74 54.61,39.12 49.53,39.12 48.77,38.35 34.54,38.35 30.03,33.84 SRAM.20
A10
  Top 0.203: S1.43 56.99,12.28 56.39,11.68 50.04,11.68 46.74,14.99 42.67,14.99 41.91,15.75 35.05,15.75 30.83,19.97 SRAM.26
A11
  Top 0.203: S1.41 55.99,14.08 55.63,13.72 48.77,13.72 46.99,15.49 42.93,15.49 42.16,16.26 35.31,16.26 31.63,19.93 SRAM.27
A12
  Top 0.203: S1.40 55.49,14.34 55.37,14.22 49.02,14.22 47.24,16 43.18,16 42.42,16.76 35.56,16.76 32.43,19.89 SRAM.28
A13
  Top 0.203: S1.35 50.68,18.17 49.02,16.51 43.43,16.51 42.67,17.27 35.81,17.27 33.23,19.86 SRAM.29
A14
  Top 0.203: S1.34 50.16,18.67 48.51,17.02 43.69,17.02 42.93,17.78 36.07,17.78 34.03,19.82 SRAM.30
A15
  Top 0.203: S1.27 49.97,22.17 49.53,22.61 40.89,22.61 40.43,22.14 SRAM.38
A16
  Top 0.203: S1.29 50.21,21.17 49.28,22.1 41.4,22.1 41.23,21.93 SRAM.39
A17
  Top 0.203: S1.33 49.9,19.17 48.26,17.53 44.2,17.53 42.03,19.69 SRAM.40
A18
  Top 0.203: S1.32 49.64,19.67 48.01,18.03 44.45,18.03 42.83,19.65 SRAM.41
A19
  Top 0.203: S1.44 57.49,12.02 56.64,11.18 49.78,11.18 46.48,14.48 42.42,14.48 41.66,15.24 34.8,15.24 30.03,20.01 SRAM.25
A20
  Top 0.203: S1.30 49.95,20.67 49.28,21.34 46.48,21.34 45.97,20.83 45.97,20.07 45.47,19.56 43.94,19.56 43.69,19.81 43.69,20.81 SRAM.42
AC3
  Top 0.178: IC1.29 17.49,3.08 18.54,2.03 R30.1
AC4
  Top 0.178: IC1.30 17.99,4.62 18.29,4.32 R29.1
AD0-JTAG_TCK  (via drill 0.38)
  Top 0.203: IC1.16 11.11,8.31 24.38,21.59 24.38,36.07 23.88,36.58 U$1.JTAG_TCK | S1.109 71.49,37.71 71.74,37.71 v73.66,39.62
  Route3 0.203: v73.66,39.62 73.66,41.15 68.07,46.74 44.45,46.74 41.66,49.53 22.61,49.53 21.08,48.01 21.08,42.93 20.07,41.91 20.07,38.35 21.34,37.08 22.1,37.08 U$1.JTAG_TCK
AD1-JTAG_TDI  (via drill 0.38)
  Top 0.203: IC1.17 10.81,6.46 v10.41,6.86 | S1.110 70.99,39.5 v70.87,39.62 | v20.07,25.4 19.56,25.91 19.56,40.13 21.08,41.66 U$1.JTAG_TDI 23.62,41.66 24.38,42.42 24.38,45.21 v23.11,46.48
  Route3 0.203: v70.87,39.62 68.07,39.62 65.28,42.42 54.86,42.42 53.34,43.94 30.23,43.94 27.69,46.48 v23.11,46.48
  Bottom 0.203: v10.41,6.86 10.92,7.37 10.92,13.72 20.07,22.86 v20.07,25.4
AD2-JTAG_TDO  (via drill 0.38)
  Top 0.203: IC1.18 11.99,8.43 24.89,21.34 24.89,38.35 24.13,39.12 U$1.JTAG_TDO | S1.106 72.52,34.17 71.63,33.27 v70.61,33.27
  Route3 0.203: U$1.JTAG_TDO 24.38,39.12 26.67,36.83 41.66,36.83 43.69,38.86 63.75,38.86 69.34,33.27 v70.61,33.27
AD3-JTAG_TMS  (via drill 0.38)
  Top 0.203: S1.107 70.99,34.67 v70.87,34.54 | IC1.19 12.49,5.89 12.19,5.59 v9.65,5.59 | v18.54,25.4 18.8,25.65 18.8,40.13 22.61,43.94 U$1.JTAG_TMS
  Route3 0.203: v70.87,34.54 70.87,35.56 65.02,41.4 30.99,41.4 28.19,44.2 U$1.JTAG_TMS
  Bottom 0.203: v9.65,5.59 9.14,6.1 9.14,14.73 14.48,20.07 14.48,23.11 16,24.64 17.78,24.64 v18.54,25.4 18.29,25.15
AD4-DTR  (via drill 0.38)
  Top 0.203: IC1.21 13.49,7.9 v14.35,8.76 | S1.45 57.99,9.73 v57.91,9.65
  Bottom 0.203: v57.91,9.65 56.9,8.64 47.5,8.64 42.16,13.97 29.21,13.97 27.18,11.94 27.18,8.38 25.65,6.86 14.73,6.86 14.48,7.11 14.48,8.64 v14.35,8.76
ARD_RESET  (via drill 0.38)
  Top 0.203: v56.9,33.78 56.9,34.29 56.49,34.7 S1.139
  Route3 0.203: v56.9,33.78 55.88,34.8 55.88,37.08 54.61,38.35 45.47,38.35 42.93,35.81 25.15,35.81 23.11,37.85 21.34,37.85 20.83,38.35 20.83,41.91 21.84,42.93 28.19,42.93 v32.51,38.61
  Bottom 0.203: U101.13 39.91,37.05 39.62,37.34 36.07,37.34 35.56,37.85 34.76,37.85 R110.1 32.73,38.82 v32.51,38.61
AREF  (via drill 0.61)
  Top 0.254: v20.57,35.31 20.57,26.42 v22.35,24.64
  Bottom 0.254: U101.42 40.41,29.23 37.34,26.16 36.59,26.16 C102.2 36.58,25.91 35.31,24.64 v22.35,24.64 | U1.AREF 24.89,49.78 24.89,41.91 23.37,40.39 21.08,40.39 20.57,39.88 v20.57,35.31
ATMEGA_A0
  Bottom 0.254: U101.41 40.91,21.32 42.42,19.81 57.15,19.81 59.18,17.78 59.18,16.51 60.45,15.24 60.45,8.38 59.18,7.11 52.83,7.11 50.8,5.08 U1.A0
ATMEGA_A1
  Bottom 0.254: U101.40 41.41,21.58 42.67,20.32 58.67,20.32 61.21,17.78 61.21,7.87 59.69,6.35 54.36,6.35 53.34,5.33 U1.A1
ATMEGA_D0/RX
  Top 0.203: U1.RX 64.77,52.07 64.77,53.85 65.02,54.1 70.1,54.1 70.65,53.56 R21.2
  Bottom 0.203: U101.20 43.41,46.46 46.99,50.04 46.99,51.56 47.5,52.07 58.93,52.07 59.69,51.31 59.69,50.29 60.71,49.28 61.98,49.28 U1.RX
ATMEGA_D1/TX  (via drill 0.38)
  Top 0.203: R20.2 65.75,51.85 v65.79,51.82
  Route3 0.203: v46.23,47.75 57.91,47.75 U1.TX
  Bottom 0.203: v65.79,51.82 64.77,51.82 64.52,52.07 62.23,52.07 U1.TX | U101.21 43.91,45.43 v46.23,47.75
ATMEGA_D2
  Top 0.203: R19.2 63.75,48.77 62.99,49.53 59.69,49.53 U1.D2
  Bottom 0.203: U101.29 53.09,32.77 55.12,34.8 55.12,47.5 U1.D2
ATMEGA_D3
  Top 0.203: U1.D3 57.15,49.53 58.67,49.53 59.69,48.51 R18.2
  Bottom 0.203: U101.28 50.29,33.27 53.09,36.07 53.09,39.37 51.82,40.64 51.82,46.74 U1.D3
ATMEGA_D4
  Top 0.203: U1.D4 R17.2
  Bottom 0.203: U101.27 50.03,33.77 52.58,36.32 52.58,39.12 51.31,40.39 51.31,48.77 U1.D4
ATMEGA_D5*
  Top 0.203: U1.D5 R16.2
  Bottom 0.203: U101.26 49.77,34.27 52.07,36.58 52.07,38.86 50.8,40.13 U1.D5
ATMEGA_D6*
  Top 0.203: U1.D6 R15.2
  Bottom 0.203: U101.25 49.51,34.77 51.56,36.83 51.56,38.35 49.28,40.64 49.28,49.78 U1.D6
ATMEGA_D7
  Top 0.203: U1.D7 R14.2
  Bottom 0.203: U101.19 42.91,47.99 U1.D7
ATMEGA_IO8
  Top 0.203: U1.D8 R13.2
  Bottom 0.203: U101.18 42.41,50.05 U1.D8
ATMEGA_IO9*
  Top 0.203: U1.D9 R12.2
  Bottom 0.203: U101.12 36.09,36.55 35.31,37.34 31.75,37.34 31.24,37.85 31.24,45.47 34.29,48.51 36.83,48.51 U1.D9
ATMEGA_IO10*  (via drill 0.38)
  Top 0.203: U1.D10 R11.2
  Route3 0.203: v37.59,34.04 37.59,34.54 37.08,35.05 v29.97,35.05
  Bottom 0.203: U101.8 37.83,34.27 v37.59,34.04 | v29.97,35.05 27.69,37.34 27.69,52.07 28.45,52.83 34.54,52.83 U1.D10
ATMEGA_IO11*
  Top 0.203: U1.D11 R10.2
  Bottom 0.203: U101.10 35.85,35.27 34.8,36.32 31.24,36.32 30.23,37.34 30.23,51.31 30.99,52.07 32.77,52.07 U1.D11
ATMEGA_IO12
  Top 0.203: U1.D12 R9.2
  Bottom 0.203: U101.11 36.11,35.77 35.05,36.83 31.5,36.83 30.73,37.59 30.73,50.04 U1.D12
ATMEGA_IO13*
  Top 0.203: R8.2 U1.D13 28.7,50.8 27.69,51.82 27.69,54.1 27.18,54.61 26.45,54.61 R7.2
  Bottom 0.203: U101.9 35.58,34.77 34.54,35.81 30.99,35.81 28.96,37.85 U1.D13
AVCC  (via drill 0.38)
  Route3 0.254: v50.55,37.59 50.55,35.81 43.69,28.96 v34.04,28.96
  Bottom 0.178: L100.2 31.47,30.56 C104.1
  Bottom 0.254: U101.24 47.21,35.27 47.75,35.81 47.75,36.83 48.51,37.59 v50.55,37.59 | U101.44 39.41,29.5 38.86,28.96 v34.04,28.96 32.64,30.35 L100.2
AVRUSB_N  (via drill 0.38)
  Top 0.178: 9.14,47.75 v9.13,47.75 9.13,48.26 9.13,49.04 8.89,49.28 7.64,49.28 R1.2
  Bottom 0.178: U101.3 29.23,31.77 26.49,29.03 13.64,29.03 9.78,32.89 8.89,33.78 8.89,47.51 v9.13,47.75
AVRUSB_P  (via drill 0.38)
  Top 0.178: v10.16,39.12 7.64,39.12 R22.2
  Bottom 0.178: U101.4 29.23,32.27 26.34,29.39 13.79,29.39 10.03,33.15 10.03,38.99 v10.16,39.12
BD0_TXD/MPSSE_TCK  (via drill 0.38)
  Top 0.203: IC1.38 19.32,10.81 v19.3,10.79 | S1.46 58.49,17.2 v58.17,17.53
  Bottom 0.203: v19.3,10.79 23.11,14.61 45.09,14.61 49.53,19.05 56.9,19.05 58.17,17.78 v58.17,17.53
BD1_RXD/MPSSE_TDI
  Top 0.203: IC1.39 25.79,11.31 26.92,12.45 26.92,38.86 29.21,41.15 50.29,41.15 51.56,39.88 54.86,39.88 55.49,39.25 S1.141
BD2_MPSSE_TDO
  Top 0.203: IC1.40 25.53,11.81 26.42,12.7 26.42,39.12 28.96,41.66 50.55,41.66 51.82,40.39 55.37,40.39 55.99,39.77 S1.140
BD3_MPSSE_TMS
  Top 0.203: S1.138 56.99,39.79 55.88,40.89 52.07,40.89 50.8,42.16 28.7,42.16 25.91,39.37 25.91,12.95 25.27,12.31 IC1.41
BD4-DTR
  Top 0.203: S1.137 57.49,40.05 56.13,41.4 52.58,41.4 51.31,42.67 28.45,42.67 25.4,39.62 25.4,18.8 23.37,16.76 23.37,15.24 21.44,13.31 IC1.43
D0
  Top 0.203: S1.14 40.68,28.67 38.83,30.51 SRAM.9
D1
  Top 0.203: S1.15 40.41,28.17 38.03,30.55 SRAM.10
D2
  Top 0.203: S1.16 39.9,27.67 39.88,27.69 38.61,27.69 35.63,30.66 SRAM.13
D3
  Top 0.203: S1.17 38.11,27.17 34.83,30.45 SRAM.14
D4
  Top 0.203: SRAM.31 34.83,22.64 37.36,25.17 S1.21
D5
  Top 0.203: SRAM.32 35.63,22.68 37.62,24.67 S1.22
D6
  Top 0.203: SRAM.35 38.03,22.54 39.66,24.17 S1.23
D7
  Top 0.203: SRAM.36 38.83,22.57 39.92,23.67 S1.24
D+
  Top 0.254: AVRUSB.P3 6.22,43.56 7.37,42.42 7.37,41.39 R22.1
D-
  Top 0.254: AVRUSB.P2 7.9,44.22 8.13,44.45 8.13,46.75 R1.1
DDC_SCL
  Bottom 0.203: R104.2 69.44,10.92 68.33,10.92 68,10.6 U100.6 68,6.93 70.1,4.83 85.85,4.83 86.87,3.81 88.14,3.81 89.92,5.59 89.92,7.11 89.66,7.37 89.66,8.64 88.14,10.16 86.36,10.16 86.11,9.91 86.11,8.73 HDMI.15
DDC_SDA
  Bottom 0.203: U100.5 69.41,10.13 R103.2 69.58,7.89 72.14,5.33 84.58,5.33 86.61,7.37 86.61,8.65 HDMI.16
DETECT  (via drill 0.38)
  Route3 0.203: v88.98,6.81 88.92,6.86 86.36,6.86 85.6,6.1 73.41,6.1 72.42,7.09 v72.42,7.37
  Bottom 0.203: R101.1 73.44,6.11 R100.2 72.43,7.38 v72.42,7.37 | HDMI.19 88.07,7.72 v88.98,6.81
EECLK
  Top 0.203: IC1.62 12.49,19.09 12.7,19.3 13.46,19.3 13.97,19.81 13.97,24.38 14.48,24.89 14.48,26.92 14.04,27.37 U3.4 13.43,28.96 R24.1
EECS
  Top 0.178: IC1.63 11.99,25.71 12.7,26.42
  Top 0.203: U3.5 12.7,26.42 12.45,26.42 12.19,26.67 R23.1
EEDATA
  Top 0.203: R25.2 15.49,27.9 U3.3 15.43,27.37 14.99,26.92 14.99,24.64 14.48,24.13 14.48,19.3 13.72,18.54 13.21,18.54 12.99,18.32 IC1.61
FB_1V2
  Top 0.203: U2.10 16.78,47.99 16,48.77 16,51.18 15.33,51.85 R5.1 15.33,52.67 15.37,52.7 16.26,52.7 16.38,52.83 16.38,53.43 R4.2
FB_3V3
  Top 0.203: U2.1 12.46,47.99 12.19,48.26 12.19,51.27 R2.1 12.45,52.36 12.45,52.7 11.77,53.38 R3.2
FLASH_CS
  Top 0.203: FLASH.1 72.9,16.26 70.87,18.29 69.34,18.29 66.55,21.08 60.96,21.08 58.93,19.05 54.86,19.05 54.36,18.54 54.36,17.27 54.49,17.14 S1.38
FLASH_SCK
  Top 0.203: S1.70 70.49,13.59 71.12,12.95 72.8,12.95 72.95,13.11 75.44,13.11 76.02,13.69 80.92,13.69 FLASH.6
FLASH_SI  (via drill 0.38)
  Top 0.203: v78.99,12.45 FLASH.5 | S1.64 67.49,18.62 v66.8,19.3
  Bottom 0.203: v78.99,12.45 77.22,12.45 71.63,18.03 68.07,18.03 v66.8,19.3
FLASH_SO
  Top 0.203: S1.65 67.99,17.44 68.33,17.78 70.61,17.78 72.14,16.26 72.14,15.24 72.39,14.99 FLASH.2
FTUSB_N
  Top 0.178: FPGAUSB.D- 9.99,33.19 10.85,32.33 10.85,27.36 9.73,26.24 3.12,26.24 2.21,25.33 2.21,14.04 3.44,12.81 IC1.7
FTUSB_P
  Top 0.178: FPGAUSB.D+ 10.29,32.38 10.49,32.18 10.49,27.51 9.58,26.59 2.97,26.59 1.85,25.47 1.85,13.9 3.44,12.31 IC1.8
GND  (via drill 0.38, 0.61, 0.61 pad 1.02)
  Top 0.178: C8.2 C9.2 | v12.19,12.19 12.19,13.72 12.09,13.81 IC1.5 | C34.2 8.09,3.16 C28.- 8.74,2.97 v9.32,2.39
  Top 0.203: S1.113 69.49,36.34 v68.96,35.81 | S1.96 72.18,29.17 v72.14,29.21 | S1.91 72.14,26.67 v71.88,26.92 | S1.60 65.49,16.97 v65.53,17.02 | S1.13 53.3,29.17 v53.34,29.21 | S1.136 57.99,35.89 v57.4,35.31 | v52.32,12.7 C24.2 | v52.83,42.67 C5.2 | FLASH.4 v75.95,12.45 | S1.108 75.04,35.17 75.44,35.56 75.44,37.03 OSC.2@2 74.02,37.19 v73.66,36.83 | C21.2 v40.64,18.8 | S1.54 62.49,16.77 v62.99,17.27 | S1.3 53.22,34.17 v53.59,34.54 | C26.2 82.98,13.39 v82.8,13.21 | S1.68 69.49,16.36 v68.83,17.02 | S1.25 53.14,23.17 v53.59,23.62 | C32.2 62.37,9.54 v63.25,10.41 | C33.2 66.65,9.3 v67.06,8.89 | S1.77 72.92,19.67 v71.88,20.7 | S1.49 59.99,17.06 v60.2,17.27 | S1.130 60.99,36.6 v59.69,35.31 | R3.1 13.37,53.17 v14.1,52.45 14.95,53.3 R4.1 14.99,53.63 14.99,54.36 15.49,54.86 17.53,54.86 18.03,54.36 18.03,52.32 18.32,52.04 PWR.C | IC1.25 v15.49,7.87 | IC1.10 IC1.11 | IC1.13 10.45,9.81 10.67,9.6 10.67,9.02 10.47,8.81 IC1.15 8.81,8.81 v8.13,8.13 | IC1.51 17.99,18.33 v17.53,18.8 | IC1.10 11.31,11.31 v12.19,12.19 | C27.2 4.87,11.09 5.08,11.3 9.63,11.3 IC1.10 | C14.- 6.05,19.28 v6.88,20.12 7.62,19.38 C15.2 | C16.2 11.05,22.17 v11.02,22.2 | R27.1 3.99,14.1 v3.5,14.58 | IC1.1 9.64,16.52 v9.4,16.76 | C30.2 23.96,8.29 v23.88,8.38 24.6,9.11 C31.2 | IC1.35 21.67,9.31 v22.35,8.64 | C20.2 24.85,15.46 v24.89,15.49 | C17.2 v12.95,20.32 | U3.2 17.02,26.42 v17.27,26.67 | C18.2 16.34,23.2 v16.76,23.62 16.79,23.6 C19.- | C9.2 7.53,24.55 v6.86,23.88 | C29.2 11.26,2.71 v11.18,2.79 | C22.2 46.95,19.77 v45.97,18.8 | C4.2 47.21,35.34 v46.48,36.07 | C11.2 78.49,33.02 78.49,33.27 v79.25,34.04 | S1.73 72.25,17.67 v70.61,19.3 | LED.C U1.GND@2 | SW2.B 29.11,12.8 v29.46,12.45
  Top 0.203: SW2.B' 35.91,12.54 v35.81,12.45
  Top 0.254: C10.2 v46.74,26.16 | C23.2 v48.77,15.75 | C25.2 v79.5,18.8 | C13.2 v81.53,25.4 | C12.2 80.9,27.05 v81.53,26.42 | C6.2 60.96,43.69 v60.71,43.94 | C7.2 62.48,43.18 v61.72,43.94 | U2.6 16.4,45.99 15.51,45.1 | 15.51,45.1 C3.1 | 14.62,45.99 U2.5 | 14.62,45.99 15.51,45.1 | C2.1 15,46.37 14.62,45.99 | IC1.47 21.92,15.31 22.1,15.49 v22.1,16.13
  Top 0.305: AVRUSB.S4 5.21,41.15
  Top 0.406: AVRUSB.P5 AVRUSB.S4 | SRAM.34 37.23,22.75 v37.34,22.86 | SRAM.12 36.43,33.67 v36.07,34.04
  Top 0.61: 14.1,50.04 C2.1 | 14.1,50.04 C1.1 | v14.1,52.45 14.1,50.04 | AVRUSB.S4 5.28,39.42 v5.59,39.12 | AVRUSB.S3 5.28,47.7 v5.59,48.01
  Route2 0.203: v46.48,36.07 46.23,36.07 | v36.83,46.23 36.83,45.97 | v87.38,4.83 87.88,4.83 | v29.46,12.45 29.72,12.45 | v35.81,12.45 35.56,12.45
  Route2 0.254: v35.05,27.18 35.05,27.69
  Bottom 0.203: U101.15 40.91,38.45 C105.2 | Y1.2 37.85,43.79 C107.2 37.45,45.61 v36.83,46.23 | U101.5 34.17,32.77 C103.2 | HDMI.5 81.07,7.15 | 81.07,7.15 81.03,7.11 v79.5,7.11 79.57,7.18 HDMI.2 | HDMI.8 82.57,7.38 82.3,7.11 | 82.3,7.11 81.11,7.11 81.07,7.15 | HDMI.11 84.07,7.61 83.57,7.11 | 83.57,7.11 82.3,7.11 | HDMI.14 85.57,7.59 85.09,7.11 83.57,7.11 | U100.1 67,14.96 68.53,16.48 68.53,16.71 v68.83,17.02 | C100.2 67.18,8.77 v67.06,8.89 | 72.28,10.56 T100.2 73.24,9.4 77.47,9.4 77.98,8.89 77.98,6.86 77.47,6.35 75.69,6.35 74.75,7.29 R100.1 | HDMI.17 87.07,5.14 v87.38,4.83
  Bottom 0.254: U101.33 44.41,30.77 43.91,31.27 | U101.5 40.12,32.77 | 40.12,32.77 40.13,32.77 | U101.23 46.19,35.77 v46.48,36.07 | C102.1 35.8,27.93 v35.05,27.18 | U101.43 39.91,31.27 40.13,31.5 40.12,31.5 40.12,32.77
  Bottom 0.279: 40.91,34.27 U101.15 | U101.35 43.91,31.27 | 44.56,35.77 U101.23
  Bottom 0.305: U101.EXP 40.91,34.27 | 43.91,31.27 U101.EXP | 44.56,35.77 44.3,35.51 44.15,35.51 U101.EXP
  other vias: 14.1,51.44 7.62,29.84 3.43,34.54 3.17,30.73 0.89,32.51 2.29,45.72 2.29,41.4 3.68,43.56 2.29,48.39 2.16,38.73 43.18,33.91 41.91,33.91 40.64,33.91 12.95,43.18 13.97,43.18
  pour Bottom (isolate 0.305, rank 3): 0,55.88 101.6,55.88 101.6,0 0,0
  pour Route2: 0,55.88 101.6,55.88 101.6,0 0,0
  pour Top: 0,36.83 10.16,36.83 10.16,27.94 0,27.94
  pour Top: 0,49.53 6.35,49.53 6.35,38.1 0,38.1
  pour Top (no thermals): 12.45,46.23 18.03,46.23 18.03,42.42 12.45,42.42
HDMI_DET#
  Bottom 0.203: R108.2 72.53,15.61 73.41,14.73 73.41,12.63 T100.3
MEGA_D0
  Top 0.203: S1.116 67.99,46.57 67.31,47.24 67.31,51.35 R21.1
MEGA_D1
  Top 0.203: S1.117 67.49,46.05 66.8,46.74 66.8,52.07 67.06,52.32 67.06,52.79 R20.1
MEGA_D2
  Top 0.203: S1.118 66.99,45.53 66.04,46.48 66.04,48.55 R19.1
MEGA_D3
  Top 0.203: S1.119 66.49,45.02 62.99,48.51 R18.1
MEGA_D4
  Top 0.203: S1.120 65.99,44.76 63.25,47.5 59.94,47.5 59.18,48.26 55.37,48.26 54.61,49.02 54.61,54.1 54.1,54.61 53.38,54.61 R17.1
MEGA_D5
  Top 0.203: S1.121 65.49,44.49 62.99,46.99 59.69,46.99 58.93,47.75 53.59,47.75 52.07,49.28 52.07,53.38 R16.1
MEGA_D6
  Top 0.203: S1.123 64.49,39.09 65.02,39.62 65.02,44.2 62.74,46.48 59.44,46.48 58.67,47.24 50.29,47.24 49.53,48.01 49.53,54.1 49.02,54.61 48.3,54.61 R15.1
MEGA_D7
  Top 0.203: S1.124 63.99,39.35 64.52,39.88 64.52,43.94 62.48,45.97 59.18,45.97 58.42,46.74 48.77,46.74 46.99,48.51 46.99,54.1 46.48,54.61 45.76,54.61 R14.1
MEGA_D8
  Top 0.203: S1.126 62.99,39.11 64.01,40.13 64.01,43.69 62.23,45.47 58.93,45.47 58.17,46.23 43.94,46.23 43.18,46.99 43.18,53.85 42.42,54.61 41.69,54.61 R13.1
MEGA_D9
  Top 0.203: S1.127 62.49,39.37 63.5,40.39 63.5,43.43 61.98,44.96 58.67,44.96 57.91,45.72 41.66,45.72 40.39,46.99 40.39,54.36 40.13,54.61 39.15,54.61 R12.1
MEGA_D10
  Top 0.203: S1.131 60.49,39.59 59.94,40.13 59.94,42.67 57.4,45.21 38.57,45.21 38.57,45.25 37.85,45.97 37.85,54.36 37.59,54.61 36.61,54.61 R11.1
MEGA_D11
  Top 0.203: S1.132 59.99,39.33 59.44,39.88 59.44,42.42 57.15,44.7 36.32,44.7 35.31,45.72 35.31,54.36 35.05,54.61 34.07,54.61 R10.1
MEGA_D12
  Top 0.203: S1.133 59.49,39.06 58.93,39.62 58.93,42.16 56.9,44.2 34.29,44.2 32.77,45.72 32.77,54.36 32.51,54.61 31.53,54.61 R9.1
MEGA_D13
  Top 0.203: S1.134 58.99,38.8 58.42,39.37 58.42,41.91 56.64,43.69 33.78,43.69 30.23,47.24 30.23,54.1 29.72,54.61 28.99,54.61 R8.1
MEGA_D14
  Top 0.203: S1.115 68.49,50.71 U1.D14
  Bottom 0.203: U101.30 53.36,32.27 55.63,34.54 55.63,45.97 58.17,48.51 66.29,48.51 U1.D14
MEGA_D15
  Top 0.203: S1.114 68.99,48.67 U1.D15
  Bottom 0.203: U101.31 53.62,31.77 56.39,34.54 56.39,44.96 58.93,47.5 67.82,47.5 U1.D15
MEGA_D16
  Top 0.203: S1.112 69.99,38.47 69.6,38.86 69.6,46.74 U1.D16
  Bottom 0.203: U101.32 61.5,31.27 65.02,34.8 65.02,42.16 U1.D16
MEGA_D17
  Top 0.203: S1.111 70.49,38.73 70.1,39.12 70.1,44.7 U1.D17
MEGA_D18
  Top 0.203: S1.105 74.81,33.67 76.71,35.56 80.52,35.56 81.03,36.07 81.03,43.43 78.74,45.72 U1.D18
MEGA_D19
  Top 0.203: S1.102 78.9,32.17 83.82,37.08 83.82,48.26 U1.D19
MEGA_D20
  Top 0.203: S1.101 79.16,31.67 84.33,36.83 84.33,50.29 U1.D20
MEGA_D21
  Top 0.203: S1.100 79.43,31.17 84.84,36.58 84.84,49.28 U1.D21
MEGA_D22
  Top 0.203: S1.99 79.94,30.67 87.12,37.85 87.12,42.67 89.41,44.96 89.41,45.97 90.68,47.24 92.46,47.24 92.71,47.5 93.22,47.5 U1.D22
MEGA_D23
  Top 0.203: U1.D23 95.76,48.26 94.49,46.99 92.96,46.99 92.71,46.74 90.93,46.74 89.92,45.72 89.92,44.7 87.63,42.42 87.63,37.59 80.2,30.17 S1.98
MEGA_D24
  Top 0.203: U1.D24 92.96,45.72 91.95,44.7 90.68,44.7 88.14,42.16 88.14,37.34 80.47,29.67 S1.97
MEGA_D25
  Top 0.203: U1.D25 95.76,45.72 94.49,44.45 93.47,44.45 92.96,43.94 92.2,43.94 91.95,44.2 90.93,44.2 90.42,43.69 90.42,43.18 88.65,41.4 88.65,37.08 80.77,29.21 76.2,29.21 75.66,28.67 S1.95
MEGA_D26
  Top 0.203: U1.D26 92.96,43.18 91.95,42.16 90.42,42.16 89.41,41.15 89.41,37.08 81.03,28.7 76.96,28.7 75.93,27.67 S1.93
MEGA_D27
  Top 0.203: U1.D27 95.76,43.18 94.49,41.91 93.47,41.91 92.96,41.4 92.2,41.4 91.95,41.66 90.68,41.66 90.17,41.15 90.17,37.08 81.28,28.19 77.22,28.19 76.19,27.17 S1.92
MEGA_D28/A5  (via drill 0.38)
  Top 0.203: S1.88 77.2,25.17 77.98,24.38 81.79,24.38 82.3,24.89 82.3,28.45 91.95,38.1 91.95,38.86 93.47,40.39 93.73,40.39 U1.D28
  Top 0.254: S1.88 69.62,25.17 69.09,24.64 61.21,24.64 v58.17,27.69
  Bottom 0.254: U101.36 43.41,25.17 43.94,24.64 50.04,24.64 53.09,27.69 v58.17,27.69 59.69,27.69 64.77,22.61 64.77,3.81 U1.A5
MEGA_D29
  Top 0.203: U1.D29 95.76,40.64 94.49,39.37 93.47,39.37 92.71,38.61 92.71,38.1 82.8,28.19 82.8,24.64 82.04,23.88 77.72,23.88 76.93,24.67 S1.87
MEGA_D30/A4  (via drill 0.38)
  Top 0.203: S1.85 77.17,23.67 77.47,23.37 82.3,23.37 83.31,24.38 83.31,27.94 93.47,38.1 U1.D30
  Top 0.254: v58.42,24.38 58.8,24 59.14,23.67 59.44,23.37 71.88,23.37 72.18,23.67 S1.85
  Bottom 0.254: U101.37 42.91,22.62 43.69,21.84 50.04,21.84 52.58,24.38 v58.42,24.38 60.96,24.38 64.26,21.08 64.26,5.84 U1.A4
MEGA_D31
  Top 0.203: U1.D31 95.76,38.1 94.49,36.83 92.96,36.83 83.82,27.69 83.82,24.13 82.55,22.86 77.22,22.86 76.91,23.17 S1.84
MEGA_D32/A3  (via drill 0.38)
  Top 0.203: S1.83 76.65,22.67 76.96,22.35 82.8,22.35 84.33,23.88 84.33,27.43 92.46,35.56 U1.D32
  Top 0.254: S1.83 58.73,22.67 v58.67,22.61
  Bottom 0.254: U101.38 42.41,22.11 43.18,21.34 52.58,21.34 53.85,22.61 v58.67,22.61 60.45,22.61 63.75,19.3 63.75,13.21 62.48,11.94 62.48,6.35 60.96,4.83 59.18,4.83 58.42,4.06 U1.A3
MEGA_D33
  Top 0.203: S1.82 76.39,22.17 76.71,21.84 83.06,21.84 84.84,23.62 84.84,27.18 91.95,34.29 94.49,34.29 95,34.8 95.76,34.8 U1.D33
MEGA_D34/A2  (via drill 0.38)
  Top 0.203: S1.81 76.12,21.67 76.45,21.34 83.31,21.34 85.34,23.37 85.34,26.92 91.44,33.02 U1.D34
  Top 0.254: S1.81 60.27,21.67 v59.44,20.83
  Bottom 0.254: U101.39 41.91,21.84 42.93,20.83 v59.44,20.83 61.72,18.54 61.72,7.37 60.2,5.84 56.64,5.84 55.88,5.08 U1.A2
MEGA_D35
  Top 0.203: S1.80 75.86,21.17 76.2,20.83 83.57,20.83 85.85,23.11 85.85,26.67 91.44,32.26 92.96,32.26 93.47,31.75 94.49,31.75 95.25,32.51 96.01,32.51 U1.D35
MEGA_D36
  Top 0.203: S1.79 75.6,20.67 75.95,20.32 83.82,20.32 86.36,22.86 86.36,26.42 90.42,30.48 U1.D36
MEGA_D37
  Top 0.203: S1.78 75.34,20.17 75.69,19.81 84.07,19.81 86.87,22.61 86.87,26.16 90.42,29.72 92.96,29.72 93.47,29.21 94.49,29.21 95.25,29.97 96.01,29.97 U1.D37
MEGA_D38
  Top 0.203: S1.75 75.31,18.67 76.2,17.78 80.01,17.78 81.28,19.05 84.07,19.05 87.38,22.35 87.38,25.91 88.39,26.92 92.46,26.92 92.71,27.18 93.73,27.18 93.98,27.43 U1.D38
MEGA_D39
  Top 0.203: S1.74 74.8,18.17 75.69,17.27 83.31,17.27 87.88,21.84 87.88,25.15 89.15,26.42 93.22,26.42 93.47,26.67 95.25,26.67 U1.D39
MEGA_D40
  Top 0.203: U1.D40 93.98,24.89 93.73,24.64 92.2,24.64 91.95,24.38 90.68,24.38 89.41,23.11 89.41,21.34 88.9,20.83 88.9,18.29 88.39,17.78 88.39,16.76 83.31,11.68 71.63,11.68 68.99,14.32 S1.67
MEGA_D41
  Top 0.203: S1.66 68.49,14.06 71.37,11.18 83.57,11.18 88.9,16.51 88.9,17.53 89.41,18.03 89.41,20.57 89.92,21.08 89.92,22.86 90.93,23.88 92.46,23.88 92.71,24.13 95.25,24.13 U1.D41
MEGA_D42
  Top 0.203: S1.62 66.49,14.28 67.06,13.72 68.07,13.72 71.12,10.67 83.82,10.67 89.41,16.26 89.41,17.27 89.92,17.78 89.92,20.32 91.19,21.59 92.2,21.59 93.22,22.61 93.73,22.61 U1.D42
MEGA_D43
  Top 0.203: S1.61 65.99,14.02 66.8,13.21 67.82,13.21 70.87,10.16 84.07,10.16 89.92,16 89.92,17.02 92.71,19.81 92.71,21.08 93.22,21.59 95.25,21.59 U1.D43
  Bottom 0.203: R106.2 68.58,13.26 U100.4 68.5,12.11 68.33,11.94 66.04,11.94 65.79,12.19 65.79,15.49 66.8,16.51 66.8,17.27 65.53,18.54 65.53,21.84 66.55,22.86 89.15,22.86 90.42,24.13 95.25,24.13 U1.D43
MEGA_D44
  Top 0.203: U1.D44 90.42,16.76 90.42,15.75 84.33,9.65 70.61,9.65 67.56,12.7 66.55,12.7 64.99,14.26 S1.59
  Bottom 0.203: R107.2 68.46,14.36 68,13.9 U100.3 68,12.63 67.82,12.45 66.55,12.45 66.29,12.7 66.29,14.99 67.56,16.26 67.56,17.27 66.04,18.8 66.04,20.57 67.06,21.59 92.71,21.59 U1.D44
MEGA_D45
  Top 0.203: U1.D45 95.76,20.32 94.49,19.05 93.47,19.05 90.93,16.51 90.93,15.49 84.58,9.14 70.36,9.14 67.31,12.19 66.29,12.19 64.49,14 S1.58
  Bottom 0.203: HDMI.1 79.07,10.97 80.01,11.91 80.01,17.6 81.43,19.02 95.22,19.02 U1.D45
MEGA_D46
  Top 0.203: U1.D46 92.96,17.78 91.44,16.26 91.44,15.24 82.55,6.35 72.39,6.35 67.06,11.68 66.04,11.68 63.99,13.74 S1.57
  Bottom 0.203: HDMI.3 80.07,11.26 80.54,11.73 80.54,17.42 81.61,18.49 93.27,18.49 U1.D46
MEGA_D47
  Top 0.203: U1.D47 95.76,17.78 94.49,16.51 93.47,16.51 82.8,5.84 72.14,5.84 66.8,11.18 65.79,11.18 63.49,13.47 S1.56
  Bottom 0.203: HDMI.4 80.57,11.05 81.08,11.56 81.08,16 81.61,16.54 95.28,16.54 U1.D47
MEGA_D48
  Top 0.203: U1.D48 92.96,15.24 83.06,5.33 71.88,5.33 66.55,10.67 65.53,10.67 62.99,13.21 S1.55
  Bottom 0.203: HDMI.6 81.57,15.6 81.97,16 93.22,16 U1.D48
MEGA_D49
  Top 0.203: U1.D49 95.76,15.24 94.49,13.97 92.46,13.97 83.31,4.83 71.63,4.83 68.33,8.13 61.47,8.13 60.45,9.14 60.45,13.21 60.99,13.74 S1.51
  Bottom 0.203: HDMI.7 82.07,11.3 84.81,14.05 95.33,14.05 U1.D49
MEGA_D50
  Top 0.203: U1.D50 92.2,12.7 83.82,4.32 71.37,4.32 68.07,7.62 61.21,7.62 59.94,8.89 59.94,13.46 60.49,14.01 S1.50
  Bottom 0.203: HDMI.9 83.07,11.59 84.99,13.51 93.17,13.51 U1.D50
MEGA_D51
  Top 0.203: U1.D51 95.76,12.7 94.49,11.43 91.69,11.43 81.79,1.52 73.41,1.52 67.82,7.11 60.96,7.11 59.49,8.58 S1.48
  Bottom 0.203: HDMI.10 83.57,11.18 85.09,12.7 91.69,12.7 92.96,11.43 95.25,11.43 U1.D51
MEGA_D52
  Top 0.203: S1.47 58.99,8.32 60.71,6.6 67.56,6.6 73.15,1.02 82.04,1.02 91.19,10.16 U1.D52
  Bottom 0.203: HDMI.12 84.57,11.41 85.34,12.19 91.44,12.19 93.47,10.16 U1.D52
MEGA_D53  (via drill 0.38)
  Top 0.203: S1.39 54.99,17.4 v55.63,18.03 | v52.07,9.65 R32.1 53.59,9.61 53.59,8.64 56.13,6.1 66.29,6.1 v67.31,5.08
  Bottom 0.203: v55.63,18.03 54.1,18.03 51.31,15.24 51.31,10.41 v52.07,9.65 | v67.31,5.08 71.12,1.27 92.96,1.27 95.25,3.56 95.25,8.89 | U1.D53 95.38,9.02 95.25,8.89 | HDMI.13 85.07,10.64 85.6,11.18 90.42,11.18 92.71,8.89 95.25,8.89
N$1  (via drill 0.38)
  other vias: 70.1,0.89
N$2
  Top 0.203: LED.A 25.56,42.26 25.15,42.67 25.15,51.78 R7.1
N$3  (via drill 0.38)
  other vias: 93.85,0.89
N$6
  Bottom 0.203: 65.73,7.1 C100.1 65.79,7.05 65.79,9.91 65.99,10.11 67,10.11 U100.8 U100.7 67.5,10.86 68.07,11.43 68.85,11.43 R105.1
N$8
  Top 0.203: PWR.A 21.09,54.14 R6.1
N$9
  Top 0.203: IC1.6 7.35,13.31 R27.2
N$17
  Bottom 0.203: T100.1 74.24,10.41 78.23,10.41 78.49,10.16 78.49,6.6 77.72,5.84 74.96,5.84 R101.2
N$22
  Top 0.178: C9.1 9.23,22.69 X1.1
  Top 0.203: IC1.2 10.49,15.31 10.67,15.49 10.67,17.78 9.4,19.05 9.4,22.35 X1.1
N$23
  Top 0.178: C8.1 4.1,22.64 X1.2
  Top 0.203: IC1.3 8.81,14.81 8.64,14.99 8.64,19.56 7.11,21.08 5.59,21.08 X1.2
N$24
  Top 0.305: R30.2 RX.C
N$25
  Top 0.305: R29.2 TX.C
N$45
  Top 0.203: R25.1 R26.1 18.07,31.08 18.29,30.86 18.29,26.42 17.4,25.53 16.09,25.53 U3.1
N$48
  Top 0.203: L3.1 4.81,16.93 C14.+ 6.11,16.93 C15.1 7.37,16.68 7.37,14.73 7.78,14.31 IC1.4
N$49
  Top 0.178: L4.1 6.39,4.46 C28.+ 6.39,3.16 C34.1
  Top 0.203: IC1.9 4.07,11.81 3.43,11.18 3.43,7.37 4.83,5.97 L4.1
OSC_IN
  Top 0.203: OSC.3@3 79.4,37.19 77.98,38.61 73.91,38.61 72.39,37.08 72.39,36.32 71.88,35.81 70.61,35.81 69.6,34.8 69.6,30.23 71.66,28.17 S1.94
RESET  (via drill 0.38)
  Top 0.203: SW2.A' 35.91,5.43 U1.RES 30.34,5.22 R31.1 27.04,5.22 26.16,6.1 26.16,8.89 27.18,9.91 29.08,9.91 SW2.A
  Top 0.254: S1.37 53.16,15.32 v53.09,15.24
  Bottom 0.203: v53.09,15.24 59.18,15.24 59.69,14.73 59.69,8.64 58.93,7.87 48.01,7.87 45.97,5.84 36.32,5.84 U1.RES
SW1
  Top 0.203: S1.104 75.08,33.17 76.96,35.05 80.77,35.05 81.53,35.81 81.53,40.39 SW1.COM2
SW_1V2
  Top 0.254: U2.8 20.15,46.99 L2.1
SW_3V3
  Top 0.254: U2.4 12.33,46.49 12.19,46.35 12.19,44.2 11.43,43.43 10.24,43.43 L1.1
TX_HDMI_5V  (via drill 0.38)
  Route3 0.203: v71.42,8.38 71.37,8.38 70.61,7.62 70.61,6.86 72.64,4.83 85.34,4.83 86.61,6.1 88.14,6.1 v88.27,5.97
  Bottom 0.203: 87.63,8.38 87.57,8.45 HDMI.18 87.57,6.67 v88.27,5.97 | R105.2 R104.1 R103.1 70.89,8.92 v71.42,8.38 71.49,8.45 R102.1
UCAP
  Bottom 0.203: U101.6 35.42,33.27 C103.1
XTAL1
  Bottom 0.203: C107.1 35.7,42.35 Y1.1 | 35.81,44.31 C107.1 | U101.17 41.91,41.15 40.39,42.67 40.01,42.67 R109.1 39.88,44.96 37.59,47.24 36.32,47.24 35.56,46.48 35.56,44.34 C107.1
XTAL2
  Bottom 0.203: C106.2 37.45,39.95 Y1.3 37.85,40.65 38.35,41.15 39.75,41.15 R109.2 40.01,41.15 40.89,41.15 41.41,40.63 U101.16
  Bottom 0.305: Y1.3 37.72,40.35

## Text on the board
tNames: GND | 3.3V | 5V | GND | 3.3V | 5V
bNames: U11
tDocu: Top silkscreen is on layer 130: tSilk | Bottom silkscreen is on layer 200
tSilk: AVR USB | W1 | W2 | AVR | GND | JTAG | 5V | FPGA USB | FPGA | W3 | W5 | 2/18/2014 | W4 | W6 | Reset | Papilio Platform | Papilio Duo | www.GadgetFactory.net | www.Papilio.cc | BPC3012 V1.0 | Copyright 2014 | Gadget Factory, LLC